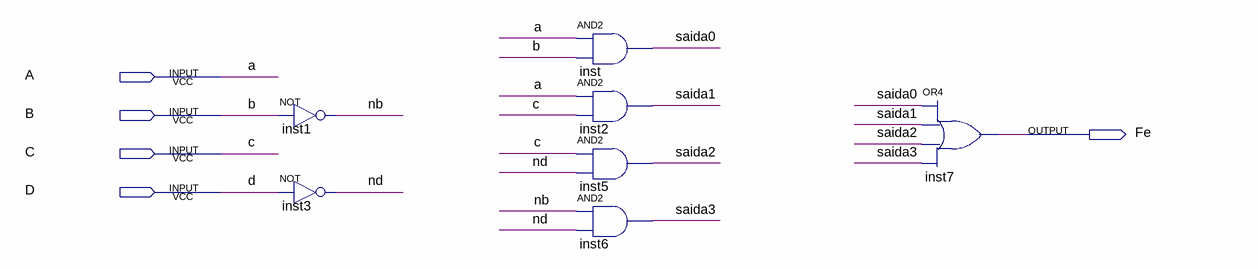
[diagram p0: schematic sheet]
// Quartus schematic FuncaoE.bdf as structural Verilog: 7 symbols, 5 pins
module FuncaoE (
  input  A,
  input  B,
  input  C,
  input  D,
  output Fe
);

  wire nb, nd, saida0, saida1, saida2, saida3;

  not inst1 (nb, B);
  not inst3 (nd, D);
  and inst (saida0, A, B);
  and inst2 (saida1, A, C);
  and inst5 (saida2, C, nd);
  and inst6 (saida3, nb, nd);
  or inst7 (Fe, saida0, saida1, saida2, saida3);
endmodule
